# EAGLE design 526_outin_pico (EAGLE 9.6.2)
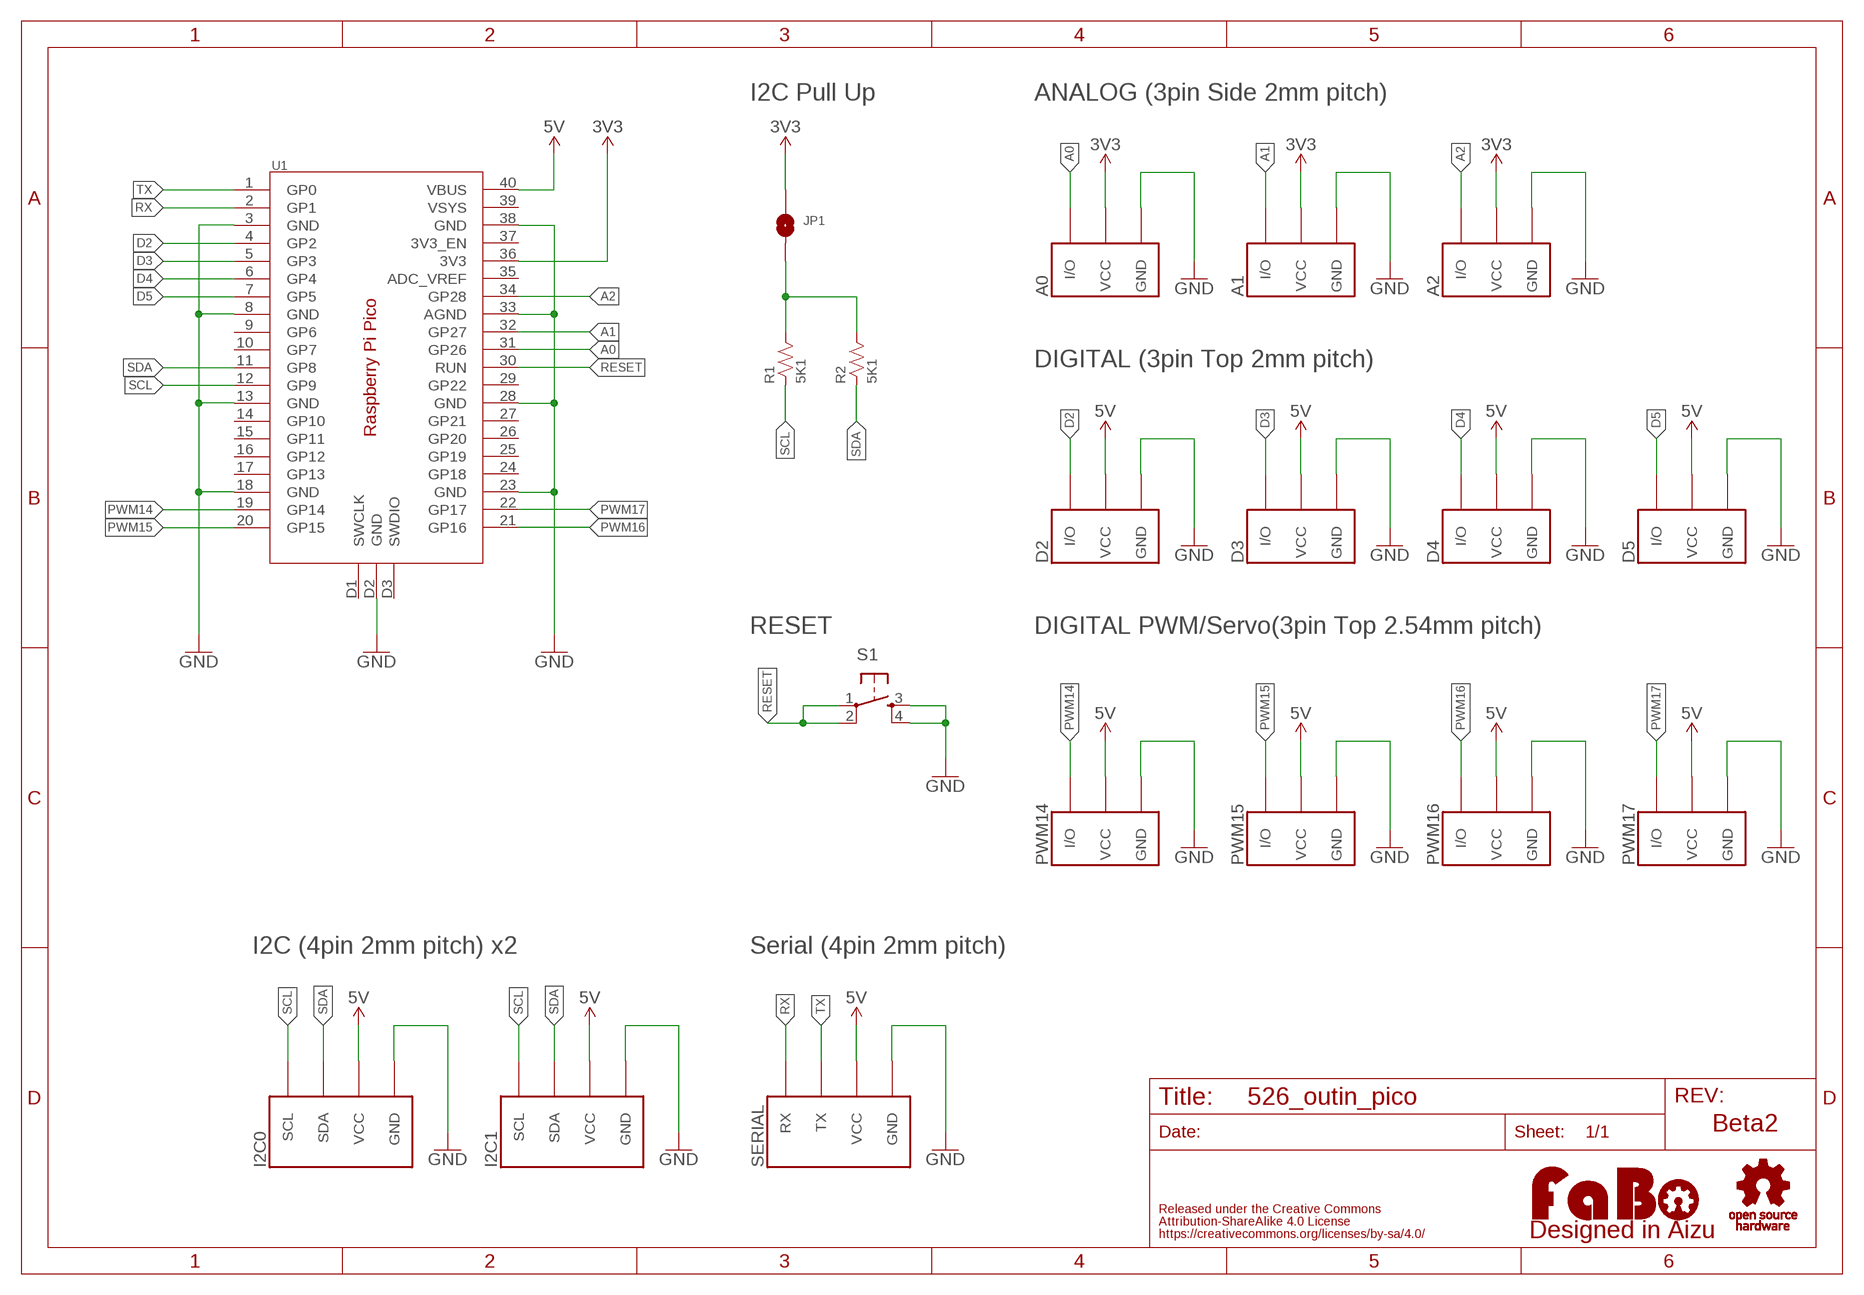
[diagram p0: schematic, sheet 1]

## Parts
A0  FABO_BRICK_3PIN-S03B-PASK-2_LONG  [FABO_BRICK_3PIN_S03B-PASK-2_LONG]
A1  FABO_BRICK_3PIN-S03B-PASK-2_LONG  [FABO_BRICK_3PIN_S03B-PASK-2_LONG]
A2  FABO_BRICK_3PIN-S03B-PASK-2_LONG  [FABO_BRICK_3PIN_S03B-PASK-2_LONG]
D2  FABO_BRICK_3PIN-B03B-PASK-1  [FABO_BRICK_3PIN_B03B-PASK-1]
D3  FABO_BRICK_3PIN-B03B-PASK-1  [FABO_BRICK_3PIN_B03B-PASK-1]
D4  FABO_BRICK_3PIN-B03B-PASK-1  [FABO_BRICK_3PIN_B03B-PASK-1]
D5  FABO_BRICK_3PIN-B03B-PASK-1  [FABO_BRICK_3PIN_B03B-PASK-1]
I2C0  FABO_BRICK_I2C-B04B-PASK-1  [FABO_BRICK_I2C_B04B-PASK-1]
I2C1  FABO_BRICK_I2C-B04B-PASK-1  [FABO_BRICK_I2C_B04B-PASK-1]
JP1  SMD-JUMPER-2_SHORT  [SMD-JUMPER-2-SHORT]
LOGO1  LOGO_OSHW-M_BOTTOM  [LOGO_OSHW_M_BOTTOM]
LOGO2  LOGO_FABO-M  [LOGO_FABO_M]
PWM14  FABO_BRICK_3PIN-HEADER  [FABO_BRICK_3PIN_HEADER]
PWM15  FABO_BRICK_3PIN-HEADER  [FABO_BRICK_3PIN_HEADER]
PWM16  FABO_BRICK_3PIN-HEADER  [FABO_BRICK_3PIN_HEADER]
PWM17  FABO_BRICK_3PIN-HEADER  [FABO_BRICK_3PIN_HEADER]
R1  5K1  RESISTOR-0603  [0603]
R2  5K1  RESISTOR-0603  [0603]
S1  TACT-SWITCH-6MM  [DTS_6_V]
SERIAL  FABO_BRICK_SERIAL-B04B-PASK-1  [FABO_BRICK_SERIAL_B04B-PASK-1]
U1  RASPBERRY_PI_PICO  [RASPBERRY_PI_PICO_SMD]

## Nets
3V3: A0.VCC A1.VCC A2.VCC JP1.1 U1.36(3V3)
5V: D2.VCC D3.VCC D4.VCC D5.VCC I2C0.VCC I2C1.VCC PWM14.VCC PWM15.VCC PWM16.VCC PWM17.VCC SERIAL.VCC U1.40(VBUS)
A0: A0.I/O U1.31(GP26)
A1: A1.I/O U1.32(GP27)
A2: A2.I/O U1.34(GP28)
D2: D2.I/O U1.4(GP2)
D3: D3.I/O U1.5(GP3)
D4: D4.I/O U1.6(GP4)
D5: D5.I/O U1.7(GP5)
GND: A0.GND A1.GND A2.GND D2.GND D3.GND D4.GND D5.GND I2C0.GND I2C1.GND PWM14.GND PWM15.GND PWM16.GND PWM17.GND S1.3 S1.4 SERIAL.GND U1.3(GND) U1.8(GND) U1.13(GND) U1.18(GND) U1.23(GND) U1.28(GND) U1.33(AGND) U1.38(GND) U1.D2(GND)
N$3: JP1.2 R1.2 R2.2
PWM14: PWM14.I/O U1.19(GP14)
PWM15: PWM15.I/O U1.20(GP15)
PWM16: PWM16.I/O U1.21(GP16)
PWM17: PWM17.I/O U1.22(GP17)
RESET: S1.1 S1.2 U1.30(RUN)
RX: SERIAL.RX U1.2(GP1)
SCL: I2C0.SCL I2C1.SCL R1.1 U1.12(GP9)
SDA: I2C0.SDA I2C1.SDA R2.1 U1.11(GP8)
TX: SERIAL.TX U1.1(GP0)
Unconnected: U1.9(GP6) U1.10(GP7) U1.14(GP10) U1.15(GP11) U1.16(GP12) U1.17(GP13) U1.24(GP18) U1.25(GP19) U1.26(GP20) U1.27(GP21) U1.29(GP22) U1.35(ADC_VREF) U1.37(3V3_EN) U1.39(VSYS) U1.D1(SWCLK) U1.D3(SWDIO)

## Notes on the sheet
- I2C Pull Up | ANALOG (3pin Side 2mm pitch)
- DIGITAL (3pin Top 2mm pitch)
- RESET | DIGITAL PWM/Servo(3pin Top 2.54mm pitch)
- I2C (4pin 2mm pitch) x2 | Serial (4pin 2mm pitch)
- Beta2

## Library data of the parts
A0 A1 A2 D2-D5 PWM14-PWM17 = FaBo-Template:FABO_BRICK_3PIN: FaBo Brick 3pin
I2C0 I2C1 = FaBo-Template:FABO_BRICK_I2C: FaBo Brick I2C
JP1 = FaBo-PIN:SMD-JUMPER-2
LOGO1 = FaBo-Logo:LOGO_OSHW
LOGO2 = FaBo-Logo:LOGO_FABO
R1 R2 = FaBo-Resistors:RESISTOR: RESISTOR
S1 = FaBo-Switch:TACT-SWITCH
SERIAL = FaBo-Template:FABO_BRICK_SERIAL: FaBo Brick Serial
U1 = FaBo-Boards:RASPBERRY_PI_PICO

## Board
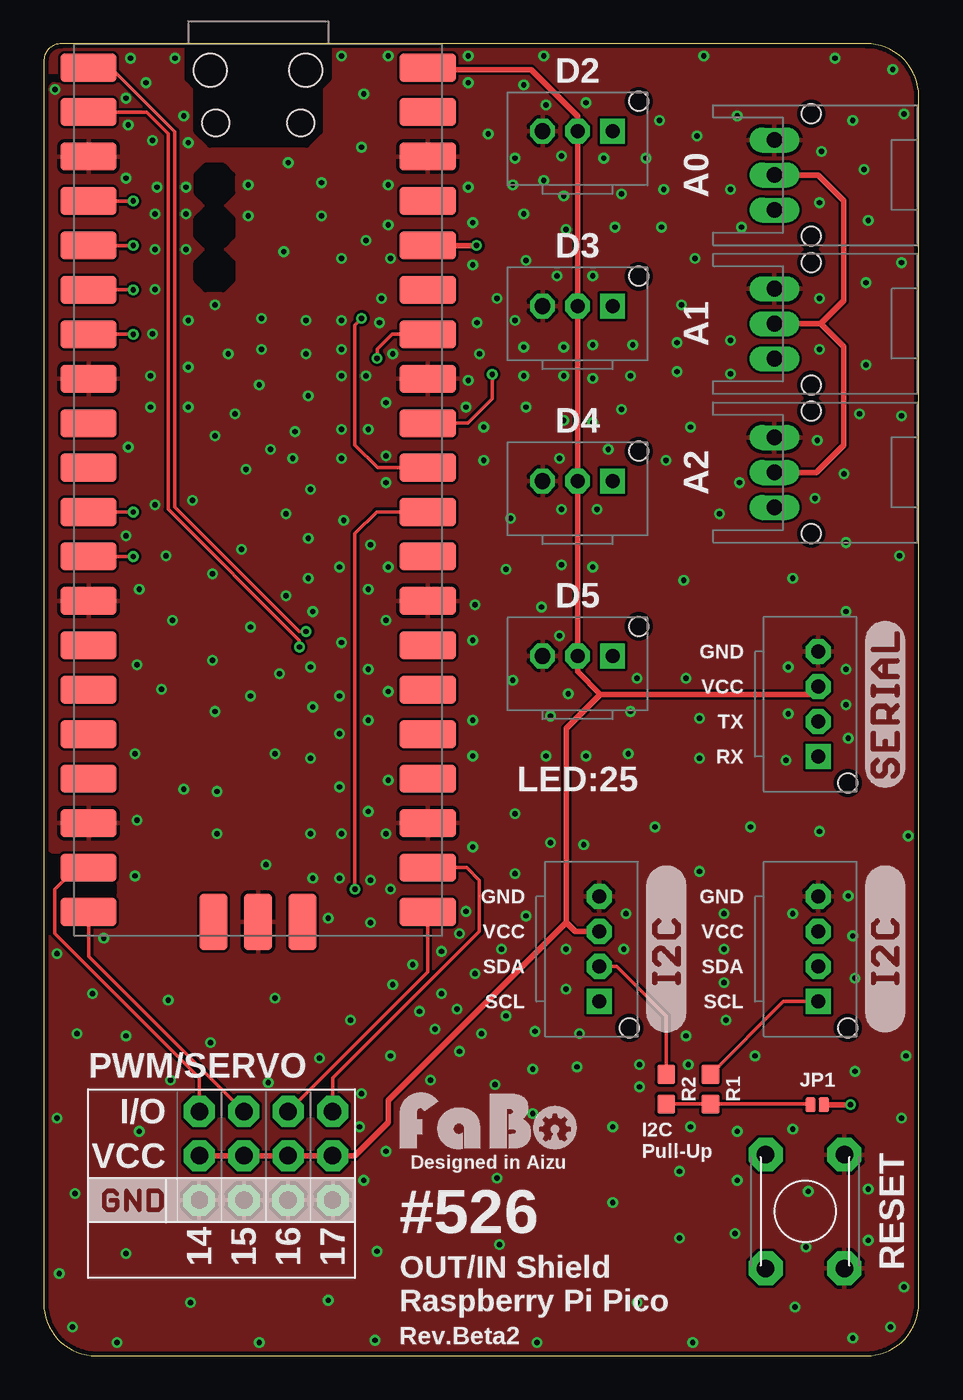
[diagram p1: board, top side]
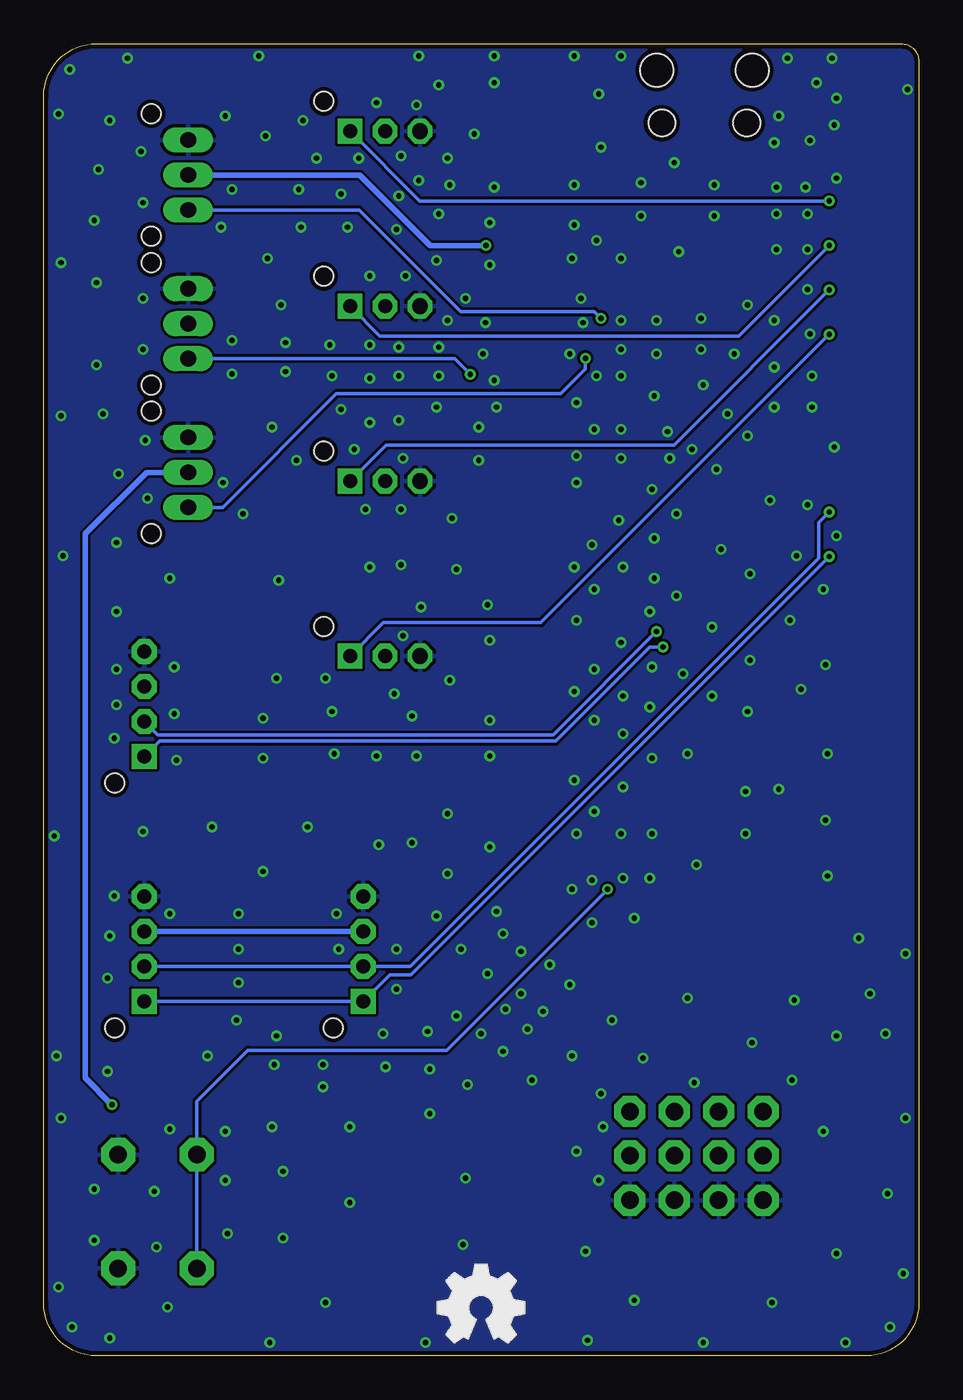
[diagram p2: board, bottom side, seen from below]

Size 50 x 75 mm. Coordinates in mm from the lower left corner, seen from the top.
Outline: 47,75 1,75 arc90 0,74 0,3 arc90 3,0 47,0 arc90 50,3 50,72 arc90 47,75
Copper layers (1*16): Top 0.035mm / dielectric 1.6mm / Bottom 0.035mm
Design rules "PCBway": minimum track width 6mil, minimum drill 12mil, track to track 6mil, track to pad 6mil, pad to pad 6mil, via to via 6mil, smd to smd 6mil, copper to edge 10mil, drill to drill 10mil, minimum pad ring 10mil, minimum via ring 6mil, stop-mask expansion 2mil, vias tented up to drill 100mil, thermal gap 8mil
tRestrict: 7 lines

### Footprints (pad centres in the part's own frame; a part is rotated, then mirrored left to right if it is on the bottom)
FABO_BRICK_3PIN_S03B-PASK-2_LONG = drill 0.9 pad 1.422 long: GND -2,0; I/O 2,0; VCC 0,0 | hole 1.1: 3.5,2.1; -3.5,2.1
FABO_BRICK_3PIN_B03B-PASK-1 = drill 0.9 pad 1.422 octagon: GND -2,0 | drill 0.8 pad 1.422 square: I/O 2,0 | drill 0.8 pad 1.422 octagon: VCC 0,0 | hole 1.1: 3.5,1.7
FABO_BRICK_I2C_B04B-PASK-1 = drill 0.8 pad 1.422 octagon: GND -3,0; SDA 1,0; VCC -1,0 | drill 0.8 pad 1.422 square: SCL 3,0 | hole 1.1: 4.5,1.7
SMD-JUMPER-2-SHORT = smd 0.61 x 0.838: 1 -0.381,0; 2 0.381,0
FABO_BRICK_3PIN_HEADER = drill 1 pad 1.778 octagon: GND -2.54,0; I/O 2.54,0; VCC 0,0
0603 = smd 1.1 x 1: 1 -0.85,0; 2 0.85,0
DTS_6_V = drill 1 pad 1.93 octagon: 1 -3.25,2.25; 2 3.25,2.25; 3 -3.25,-2.25; 4 3.25,-2.25
FABO_BRICK_SERIAL_B04B-PASK-1 = drill 0.8 pad 1.422 octagon: GND -3,0; TX 1,0; VCC -1,0 | drill 0.8 pad 1.422 square: RX 3,0 | hole 1.1: 4.5,1.7
RASPBERRY_PI_PICO_SMD = smd 3.2 x 1.6: 1 -9.69,24.13; 2 -9.69,21.59; 3 -9.69,19.05; 4 -9.69,16.51; 5 -9.69,13.97; 6 -9.69,11.43; 7 -9.69,8.89; 8 -9.69,6.35; 9 -9.69,3.81; 10 -9.69,1.27; 11 -9.69,-1.27; 12 -9.69,-3.81; 13 -9.69,-6.35; 14 -9.69,-8.89; 15 -9.69,-11.43; 16 -9.69,-13.97; 17 -9.69,-16.51; 18 -9.69,-19.05; 19 -9.69,-21.59; 20 -9.69,-24.13; 21 9.69,-24.13; 22 9.69,-21.59; 23 9.69,-19.05; 24 9.69,-16.51; 25 9.69,-13.97; 26 9.69,-11.43; 27 9.69,-8.89; 28 9.69,-6.35; 29 9.69,-3.81; 30 9.69,-1.27; 31 9.69,1.27; 32 9.69,3.81; 33 9.69,6.35; 34 9.69,8.89; 35 9.69,11.43; 36 9.69,13.97; 37 9.69,16.51; 38 9.69,19.05; 39 9.69,21.59; 40 9.69,24.13 | smd 1.6 x 3.2: D1 -2.54,-24.7; D2 0,-24.7; D3 2.54,-24.7 | hole 1.9: 2.725,24; -2.725,24 | hole 1.55: 2.425,20.97; -2.425,20.97

### Placement (x,y rotation side)
A0  41.75,67.5 270 top
A1  41.75,59 270 top
A2  41.75,50.5 270 top
D2  30.5,70 0 top
D3  30.5,60 0 top
D4  30.5,50 0 top
D5  30.5,40 0 top
I2C0  31.75,23.25 270 top
I2C1  44.25,23.25 270 top
JP1  44.2,14.35 180 top
LOGO1  25,2.75 0 top
LOGO2  25.4,11.43 0 top
PWM14  8.89,11.43 90 top
PWM15  11.43,11.43 90 top
PWM16  13.97,11.43 90 top
PWM17  16.51,11.43 90 top
R1  38.1,15.24 270 top
R2  35.56,15.24 270 top
S1  43.5,8.25 90 top
SERIAL  44.25,37.25 270 top
U1  12.25,49.5 0 top
U$2  [LOGO_SILK_SERIAL2]  49.25,37.25 90 top
U$11  [LOGO_SILK_I2C]  49.25,23.25 90 top
U$12  [LOGO_SILK_I2C]  36.75,23.25 90 top
U$19  [LOGO_SILK_GND]  3.17,7.62 0 top

### Tracks (layer width: path | path; a pad name or v marks a point on that pad's centre or on a via)
3V3  (via drill 0.3)
  Top 0.305: U1.36 v24.73,63.47 | A0.VCC 44.26,67.5 45.72,66.04 45.72,60.33 44.4,59 | A1.VCC 44.4,59 | A2.VCC 44.15,50.5 45.72,52.07 45.72,57.67 44.4,59 | JP1.1 v46.1,14.35
  Bottom 0.305: A0.VCC 31.94,67.5 27.91,63.47 v24.73,63.47 | v46.1,14.35 47.62,15.88 47.62,46.99 44.12,50.5 A2.VCC
5V
  Top 0.305: U1.40 22.07,73.5 27.84,73.5 30.5,70.85 D2.VCC D3.VCC D4.VCC D5.VCC 30.5,39.11 31.8,37.81 | 31.8,37.81 29.84,35.84 29.84,24.77 | PWM14.VCC PWM15.VCC PWM16.VCC PWM17.VCC 17.78,11.43 19.68,13.34 19.68,14.61 29.84,24.77 | I2C0.VCC 30.36,24.25 29.84,24.77 | SERIAL.VCC 43.81,37.81 31.8,37.81
  Bottom 0.305: I2C0.VCC I2C1.VCC
A0  (via drill 0.3)
  Top 0.203: U1.31 19.08,50.77 17.78,52.07 17.78,58.93 v18.16,59.31
  Bottom 0.203: v18.16,59.31 18.54,59.69 26.16,59.69 31.97,65.5 A0.I/O
A1  (via drill 0.3)
  Top 0.203: U1.32 24.23,53.31 25.62,54.71 v25.62,56.1
  Bottom 0.203: v25.62,56.1 26.52,57 A1.I/O
A2  (via drill 0.3)
  Top 0.203: U1.34 19.91,58.39 19.05,57.53 v19.05,57.02
  Bottom 0.203: v19.05,57.02 19.05,56.39 20.45,54.99 33.27,54.99 39.77,48.5 A2.I/O
D2  (via drill 0.3)
  Top 0.203: U1.4 v5.11,66.01
  Bottom 0.203: v5.11,66.01 28.51,66.01 D2.I/O
D3  (via drill 0.3)
  Top 0.203: U1.5 v5.11,63.47
  Bottom 0.203: D3.I/O 30.79,58.29 10.29,58.29 v5.11,63.47
D4  (via drill 0.3)
  Top 0.203: U1.6 v5.11,60.93
  Bottom 0.203: D4.I/O 30.43,52.07 13.97,52.07 v5.11,60.93
D5  (via drill 0.3)
  Top 0.203: U1.7 v5.11,58.39
  Bottom 0.203: D5.I/O 30.59,41.91 21.59,41.91 v5.11,58.39
GND  (via drill 0.3)
  other vias: 4.7,71.88 4.95,74.17 7.49,74.17 5.84,72.77 6.22,69.47 8,70.87 0.64,72.39 4.83,70.36 9.65,44.7 24.77,59.05 27.43,57.66 24.64,21.84 22.73,23.11 3.43,23.88 0.76,22.99 23.75,24.13 19.81,26.67 24.13,25.4 19.18,59.05 19.94,57.28 18.41,56.01 24.26,74.3 19.68,74.3 17.02,74.3 6.48,66.8 8.13,66.8 8.13,65.28 6.35,65.28 6.35,63.25 6.35,60.96 8.13,63.25 8.26,59.18 8.26,56.52 6.22,58.42 6.1,56.01 9.78,60.07 4.7,67.31 8.26,69.34 8.26,54.23 6.1,54.23 24.26,72.77 27.43,72.64 28.57,74.3 48.51,73.53 45.21,74.17 37.72,74.3 24.13,54.23 24.26,55.75 24.89,57.28 19.56,54.48 18.54,52.96 19.56,51.44 17.02,52.96 17.02,51.31 14.35,52.83 14.22,51.31 17.02,56.01 17.02,57.53 17.02,59.18 19.3,60.45 25.91,60.45 26.92,59.18 27.43,56.01 27.56,54.23 25.15,53.09 25.15,51.18 19.56,49.91 29.34,61.72 28.57,67.18 24.26,66.8 28.7,71.5 30.99,71.63 32,68.45 29.59,68.58 34.42,68.45 19.81,62.74 22.73,20.7 29.72,57.66 31.37,57.78 29.72,56.01 31.37,55.88 31.37,53.34 29.72,53.47 29.46,51.31 32.26,51.82 33.02,54.1 33.53,56.01 17.14,47.75 15.24,49.53 12.95,51.82 11.56,50.67 13.84,48.13 15.11,46.74 16.89,45.09 18.67,46.35 18.54,43.81 15.11,44.45 19.68,64.64 18.41,63.75 17.02,62.74 14.99,59.18 14.99,57.28 10.54,57.28 12.32,55.5 12.45,59.31 12.45,57.53 10.92,53.85 9.78,52.58 15.11,54.86 19.68,66.93 11.68,66.93 11.68,65.15 15.88,65.15 15.88,67.06 13.72,63.12 13.97,68.2 18.29,72.14 18.16,69.09 25.4,69.85 26.92,68.45 26.8,66.93 49.15,70.99 39.88,64.52 33.66,57.78 31.37,61.72 35.18,70.61 39.62,70.87 46.23,70.61 37.21,62.74 39.24,58.04 39.24,56.13 36.45,60.07 37.34,69.72 38.61,48.13 39.75,49.91 36.96,53.09 35.56,51.18 31.62,48.39 29.59,48.39 49.02,62.48 49.02,53.72 48.9,45.72 29.59,45.21 31.37,45.09 29.46,41.15 28.45,42.8 24.64,42.93 24.51,40.89 19.68,45.09 26.67,47.88 26.42,44.96 36.58,44.32 42.55,36.7 42.55,39.37 42.42,34.04 37.47,34.16 37.47,36.45 36.7,38.73 33.91,38.73 29.97,37.85 33.53,36.83 33.4,34.42 28.7,34.29 30.99,34.29 28.96,36.58 24.51,34.29 24.51,36.32 26.8,38.61 19.56,42.04 17.02,40.77 18.54,39.24 16.89,37.72 15.37,42.55 15.24,39.37 15.37,37.08 16.89,35.56 18.54,36.32 19.68,37.97 19.68,32.89 19.56,29.84 18.54,31.11 16.89,32.51 15.24,34.16 18.67,24.77 18.67,27.18 16.89,27.3 15.37,27.3 16.26,25.02 15.24,29.84 17.02,29.84 24.51,29.08 26.92,30.99 28.96,29.34 30.86,29.21 26.16,23.24 27.56,25.15 29.84,23.24 33.15,23.24 33.27,25.27 37.47,27.69 42.8,25.27 38.86,23.24 38.86,25.27 38.86,21.34 38.99,19.18 29.84,20.95 26.42,19.43 23.62,19.81 25.02,18.41 22.35,18.67 23.75,17.4 21.08,22.35 19.94,21.21 21.46,19.68 26.92,27.56 44.32,29.97 40.39,30.23 34.92,30.23 49.4,29.72 49.28,17.14 40.64,17.14 36.7,18.29 34.04,16.64 27.94,16.38 28.07,18.54 27.94,13.84 25.78,15.49 32.51,13.08 34.04,15.37 30.48,16.51 30.61,18.41 39.62,12.83 42.8,12.95 36.83,16.64 36.96,13.08 49.02,13.59 39.62,10.03 39.5,6.99 43.69,9.4 43.56,6.22 47.12,9.53 47.12,6.6 49.15,3.94 48.39,1.65 46.23,1.02 28.19,0.76 18.92,0.89 37.08,0.76 1.65,1.65 0.89,4.7 4.19,0.76 12.32,0.76 16.26,3.17 8.38,3.05 33.91,3.05 42.93,2.79 18.03,13.08 19.56,11.68 18.29,10.03 19.05,5.97 4.7,5.84 0.76,13.59 1.78,9.27 1.91,18.41 4.7,18.29 7.11,20.32 18.16,14.99 15.75,17.02 12.83,15.62 7.24,15.75 9.53,17.91 2.79,20.7 5.46,12.83 19.81,17.14 17.53,19.18 22.1,15.75 13.21,20.45 5.21,27.43 9.91,29.84 9.91,32.26 9.78,36.83 5.21,34.42 5.46,43.81 6.99,45.72 7.37,42.04 11.3,46.1 9.65,39.75 11.81,41.66 13.84,43.43 11.81,37.72 13.46,38.99 13.21,34.42 5.33,30.61 8,32.38 12.7,28.07 6.73,38.1 6.35,48.64 8.51,48.9 4.83,51.94 4.7,46.86 5.33,39.5 32.51,8.76 36.32,10.54 36.32,6.73 25.91,10.16 26.04,6.35 42.8,44.45 36.2,56.26 36.2,57.91 45.72,50.42 46.61,53.85 46.99,56.64 46.99,61.34 47.12,64.9 46.86,67.82 29.72,66.29 29.84,64.39 27.43,65.28 46.35,16.26 46.35,21.59 46.23,24 45.97,26.29 45.85,37.21 45.97,35.31 45.85,39.24 45.85,42.55 45.85,46.48 44.07,49.02 44.2,52.32 44.32,57.53 44.32,60.45 44.32,65.91 44.45,68.83 39.24,66.67 35.43,66.67 35.31,64.52 33.02,66.42 32.64,64.52 27.56,62.61 24.51,62.36 24.51,64.77
  pour Top (isolate 0.152, rank 3): 0,0 0,75 50,75 50,0
  pour Bottom (isolate 0.152, rank 3): 0,0 0,75 50,75 50,0
N$3
  Top 0.203: R2.2 R1.2 43.78,14.39 JP1.2
PWM14
  Top 0.203: U1.19 1.88,27.91 0.64,26.67 0.64,24.13 8.89,15.88 PWM14.I/O
PWM15
  Top 0.203: U1.20 2.56,22.84 PWM15.I/O
PWM16
  Top 0.203: U1.21 21.94,21.94 PWM16.I/O
PWM17
  Top 0.203: U1.22 24.16,27.91 24.89,27.18 24.89,24.26 16.51,15.88 PWM17.I/O
RESET  (via drill 0.3)
  Top 0.203: U1.30 19.02,48.23 17.78,46.99 v17.78,26.67
  Bottom 0.203: v17.78,26.67 26.98,17.47 38.33,17.47 41.25,14.55 S1.2 S1.1
RX  (via drill 0.3)
  Top 0.203: U1.2 5.87,71.09 7.11,69.85 7.11,48.39 14.61,40.89 v14.61,40.51
  Bottom 0.203: v14.61,40.51 15.37,40.51 20.75,35.13 43.37,35.13 SERIAL.RX
SCL  (via drill 0.3)
  Top 0.203: U1.12 v5.11,45.69 | R1.1 42.26,20.25 I2C1.SCL
  Bottom 0.203: v5.11,45.69 29.03,21.77 30.23,21.77 I2C0.SCL I2C1.SCL
SDA  (via drill 0.3)
  Top 0.203: U1.11 v5.11,48.23 | R2.1 35.56,19.43 32.74,22.25 I2C0.SDA
  Bottom 0.203: v5.11,48.23 5.71,47.62 5.71,45.59 29.06,22.25 I2C0.SDA I2C1.SDA
TX  (via drill 0.3)
  Top 0.203: U1.1 3.84,73.63 7.49,69.98 7.49,48.51 14.61,41.4 v14.99,41.4
  Bottom 0.203: v14.99,41.4 20.9,35.49 43.49,35.49 SERIAL.TX

### Text on the board
tPlace: GND | VCC | TX | RX | LED:25 | GND | GND | VCC | VCC | SDA | SDA | SCL | SCL | PWM/SERVO | I/O | I2C / Pull-Up | VCC | Designed in Aizu | RESET | 14 | 15 | 16 | 17 | #526 | OUT/IN Shield / Raspberry Pi Pico | Rev.Beta2